# Altium schematic sheet UBC-Thunderbots_PCB_Power__archive_power-v2.2_pcb__chicker.SchDoc
size A4
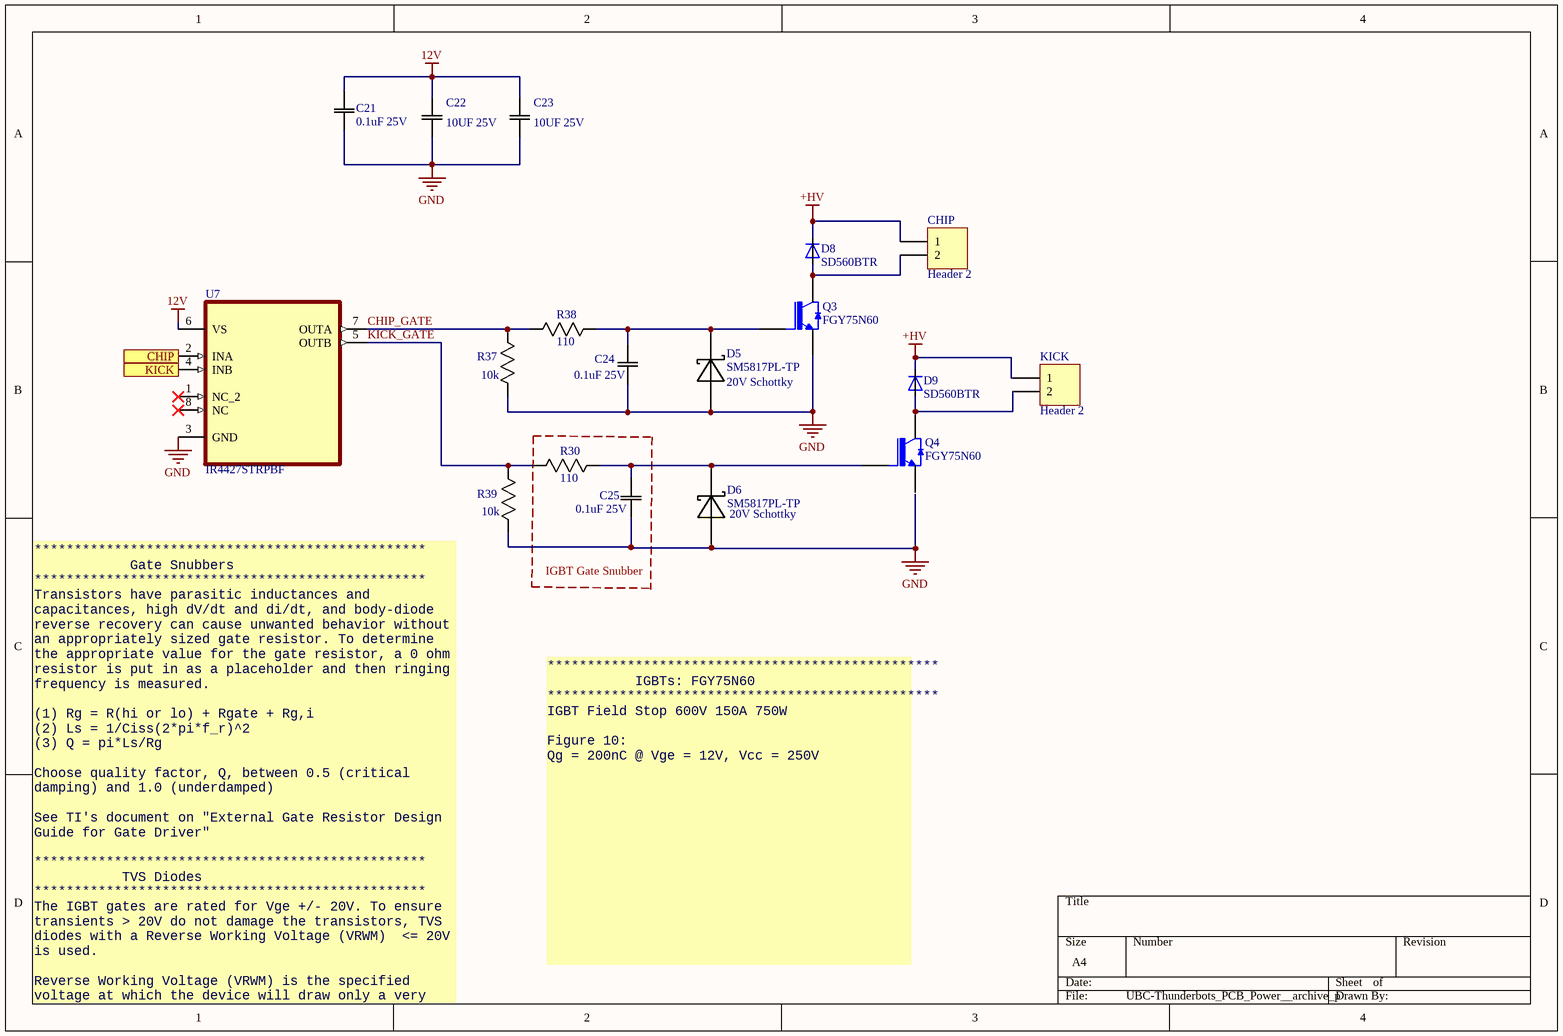
[diagram p0: UBC-Thunderbots_PCB_Power__archive_power-v2.2_pcb__chicker.SchDoc]

## Parts
C21  0.1uF 25V  [0805]
C22  10UF 25V  [1206]
C23  10UF 25V  [1206]
C24  0.1uF 25V  [0805]
C25  0.1uF 25V  [0805]
CHIP  Header 2  [HDR1X2]
D5  SM5817PL-TP  [SOD-123]
D6  SM5817PL-TP  [SOD-123]
D8  SD560BTR  [DO-214AA]
D9  SD560BTR  [DO-214AA]
KICK  Header 2  [HDR1X2]
Q3  FGY75N60  [TO-247-3]
Q4  FGY75N60  [TO-247-3]
R30  110  [0805]
R37  10k  [0805]
R38  110  [0805]
R39  10k  [0805]
U7  IR4427STRPBF  [8-SOIC]

## Ports
CHIP (in), KICK (in)

## Nets
12V: C21.2(C2) C22.1(C1) C23.1(C1) U7.6(VS)
+HV: CHIP.1 D8.C D9.C KICK.1
GND: C21.1(C1) C22.2(C2) C23.2(C2) C24.1(C1) C25.1(C1) D5.A D6.A Q3.3(E) R37.2(R2) R39.2(R2) U7.3(GND)
CHIP: U7.2(INA) ; port CHIP
CHIP_GATE: R37.1(R1) R38.2(R2) U7.7(OUTA)
KICK: U7.4(INB) ; port KICK
KICK_GATE: R30.2(R2) R39.1(R1) U7.5(OUTB)
NetC24_2: C24.2(C2) D5.C(K) Q3.1(G) R38.1(R1)
NetC25_2: C25.2(C2) D6.C(K) Q4.1(G) R30.1(R1)
NetCHIP_2: CHIP.2 D8.A Q3.2(C)
NetD9_A: D9.A KICK.2 Q4.2(C)

Not connected (* = marked no-connect by the designer): Q4 3(E); U7 1(NC_2)* 8(NC)*

## Notes on the sheet
- (near D5) 20V Schottky
- (near D6) 20V Schottky
- IGBT Gate Snubber
- *************************************************
  IGBTs: FGY75N60
  *************************************************
  IGBT Field Stop 600V 150A 750W
  Figure 10:
  Qg = 200nC @ Vge = 12V, Vcc = 250V
- *************************************************
  Gate Snubbers
  *************************************************
  Transistors have parasitic inductances and capacitances, high dV/dt and di/dt, and body-diode reverse recovery can cause unwanted behavior without an appropriately sized gate resistor. To determine the appropriate value for the gate resistor, a 0 ohm resistor is put in as a placeholder and then ringing frequency is measured.
  (1) Rg = R(hi or lo) + Rgate + Rg,i
  (2) Ls = 1/Ciss(2*pi*f_r)^2
  (3) Q = pi*Ls/Rg
  Choose quality factor, Q, between 0.5 (critical damping) and 1.0 (underdamped)
  See TI's document on "External Gate Resistor Design Guide for Gate Driver"
  *************************************************
  TVS Diodes
  *************************************************
  The IGBT gates are rated for Vge +/- 20V. To ensure transients > 20V do not damage the transistors, TVS diodes with a Reverse Working Voltage (VRWM)  <= 20V is used.
  Reverse Working Voltage (VRWM) is the specified voltage at which the device will draw only a very small leakage current.

## Library data of the parts
C21 C24 C25 = CAP 0.1uF 25V: CAP CER 0.1UF 25V X7R 0805; Tolerance: 10%; Value: 0.1uF; Temperature Coefficient: X7R; Rating: 25V; Operating Temperature: -55°C ~ 125°C
C22 C23 = CAP 10uF 25V: CAP CER 10UF 25V X5R 1206; Tolerance: 10%; Package: 1206; Value: 10uF; Rating: 25V; Temperature Coefficient: X5R; Operating Temperature: -55°C ~ 85°C
CHIP KICK = Header 2: Header, 2-Pin; LatestRevisionDate: 17-Jul-2002; LatestRevisionNote: Re-released for DXP Platform.; Publisher: Altium Limited
D5 D6 = SM5817PL-TP: Diode Schottky 20V 1A Surface Mount SOD-123FL; MF: Micro Commercial Co; ComponentLink1Description: digikey; ComponentLink1URL: https://www.digikey.ca/product-detail/en/on-semiconductor/MBR0540T1G/MBR0540T1GOSCT-ND/917967; Digikey: SM5817PL-TPMSCT-ND; Digikey Link: https://www.digikey.ca/product-detail/en/micro-commercial-co/SM5817PL-TP/SM5817PL-TPMSCT-ND/1793410; MP: SM5817PL-TP; Voltage Rating: 20V; Package: SOD-123; Current Rating: 1A
D8 D9 = SD560BTR: Diode Standard 600V 5A Surface Mount SMB; Supplier 1: Digi-Key
Q3 Q4 = FGY75N60SMD: IGBT Field Stop 600V 150A 750W Through Hole PowerTO-247-3; MF: ON Semiconductor; Vge max: ±20V; Topology: Field Stop IGBT; Vce max: 600V; Package: TO-247 Fairchild Semiconductor; MP: FGY75N60SMD; Ic max: 150A; Power: 750W; Supplier 1: Digi-Key
R30 R38 = RES 110 1/8W: RES SMD 110 OHM 1% 1/8W 0805; Power (Watts): 0.125W; Package: 0805; Value: 110; Tolerance: 1%
R37 R39 = RES 10k 1/8W: RES SMD 10K OHM 1% 1/8W 0805; Power (Watts): 0.125W; Package: 0805; Value: 10k; Tolerance: 1%
U7 = IR4427STRPBF: Low-Side Gate Driver IC Non-Inverting 8-SOIC; MF: Infineon Technologies; Package: SOIC-8 Infineon; Price: None; Availability: Unavailable; MP: IR4427STRPBF; SnapEDA_Link: https://www.snapeda.com/parts/IR4427STRPBF/Infineon%20Technologies/view-part/1815787/?ref=snap; Value: *; Supplier 1: Digi-Key